# EAGLE design isl-test (EAGLE 6.1)
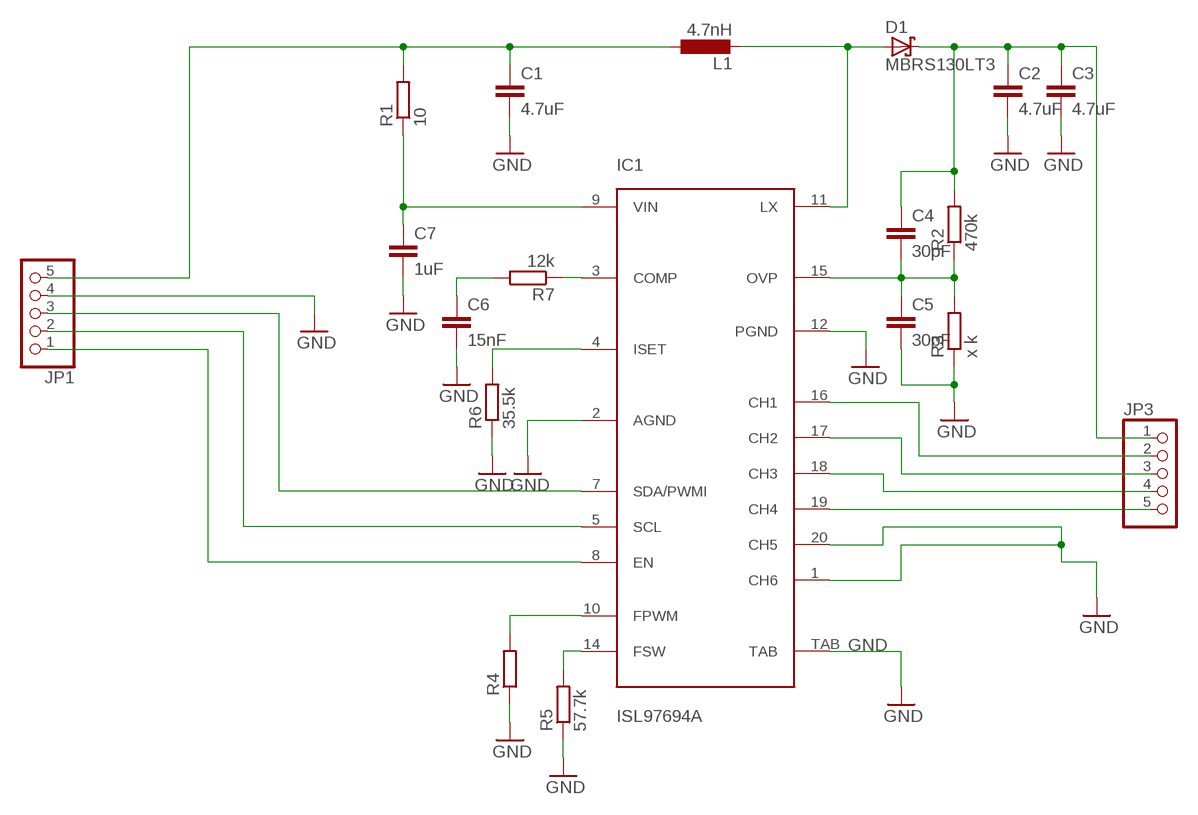
[diagram p0: schematic, sheet 1]

## Parts
C1  4.7uF  C-EUC0805  [C0805]
C2  4.7uF  C-EUC0805  [C0805]
C3  4.7uF  C-EUC0805  [C0805]
C4  30pF  C-EUC0603  [C0603]
C5  30pF  C-EUC0603  [C0603]
C6  15nF  C-EUC0603  [C0603]
C7  1uF  C-EUC0603  [C0603]
D1  MBRS130LT3  [SMB]
IC1  ISL97694A  [TQFN-20]
JP1  PINHD-1X5  [1X05]
JP3  PINHD-1X5  [1X05]
L1  4.7nH  L-EUL1812  [L1812]
R1  10  R-EU_R0603  [R0603]
R2  470k  R-EU_R0603  [R0603]
R3  x k  R-EU_R0603  [R0603]
R4  R-EU_R0603  [R0603]
R5  57.7k  R-EU_R0603  [R0603]
R6  35.5k  R-EU_R0603  [R0603]
R7  12k  R-EU_R0603  [R0603]

## Nets
GND: C1.2 C2.2 C3.2 C5.2 C6.2 C7.2 IC1.1(CH6) IC1.2(AGND) IC1.12(PGND) IC1.20(CH5) IC1.TAB JP1.4 R3.1 R4.1 R5.1 R6.1
N$2: C1.1 JP1.5 L1.1 R1.2
N$3: D1.A IC1.11(LX) L1.2
N$5: C4.2 C5.1 IC1.15(OVP) R2.1 R3.2
N$6: C2.1 C3.1 C4.1 D1.C JP3.1 R2.2
N$8: IC1.3(COMP) R7.1
N$9: C6.1 R7.2
N$11: IC1.4(ISET) R6.2
N$12: IC1.10(FPWM) R4.2
N$13: IC1.14(FSW) R5.2
N$14: IC1.8(EN) JP1.1
N$15: IC1.5(SCL) JP1.2
N$16: IC1.7(SDA/PWMI) JP1.3
N$21: IC1.16(CH1) JP3.2
N$22: IC1.17(CH2) JP3.3
N$23: IC1.18(CH3) JP3.4
N$24: IC1.19(CH4) JP3.5
VIN: C7.1 IC1.9(VIN) R1.1

## Library data of the parts
C1-C7 = rcl:C-EU: CAPACITOR, European symbol
D1 = diode:MBRS130LT3: Schottky Power Rectifier Source: http://www.onsemi.com/pub/Collateral/MBRS130LT3-D.PDF
IC1 = xtort:ISL97694A
JP1 JP3 = pinhead:PINHD-1X5: PIN HEADER
L1 = rcl:L-EU: INDUCTOR, European symbol
R1-R7 = rcl:R-EU_: RESISTOR, European symbol

## Board
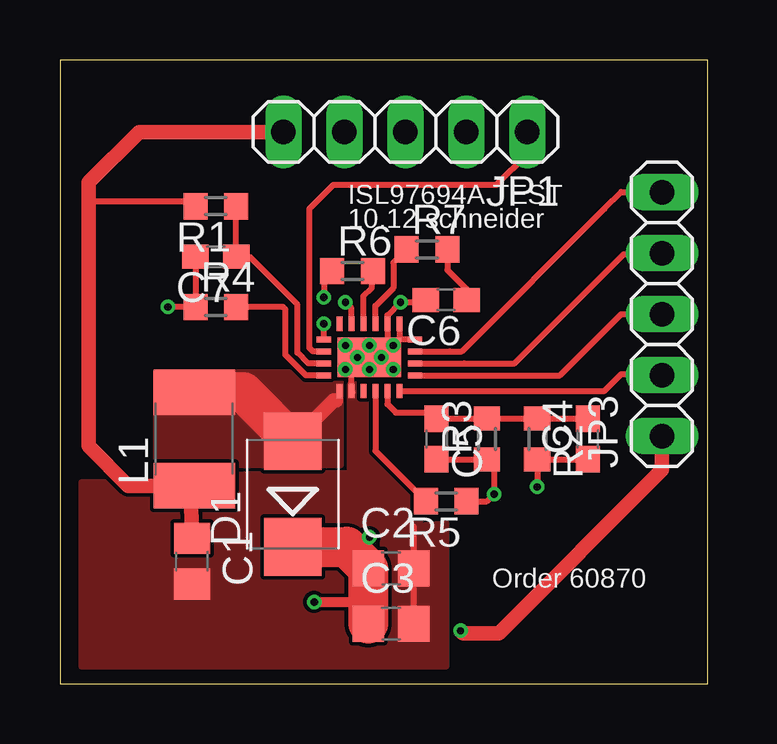
[diagram p1: board, top side]
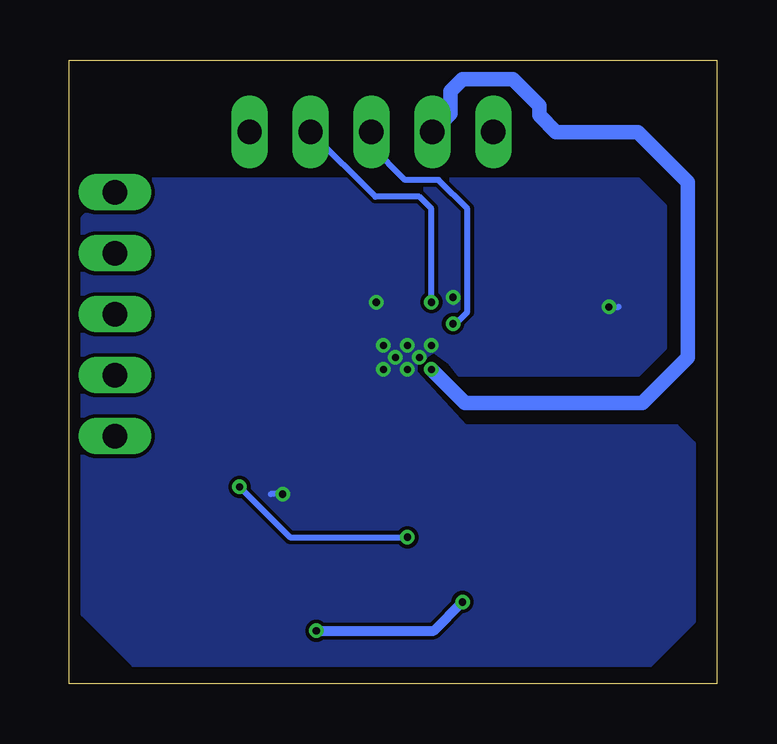
[diagram p2: board, bottom side, seen from below]

Size 27 x 26 mm. Coordinates in mm from the lower left corner, seen from the top.
Outline: 0,26 0,0 27,0 27,26 0,26
Copper layers (1*16): Top 0.035mm / dielectric 1.5mm / Bottom 0.035mm
Design rules: minimum track width 6mil, minimum drill 0.3mm, track to track 6mil, track to pad 6mil, pad to pad 6mil, via to via 6mil, smd to smd 0mil, copper to edge 10mil, drill to drill 10mil, minimum pad ring 10mil, minimum via ring 6mil, stop-mask expansion 2mil, vias tented up to drill 100mil, thermal gap 10mil

### Footprints (pad centres in the part's own frame; a part is rotated, then mirrored left to right if it is on the bottom)
C0805 = smd 1.3 x 1.5: 1 -0.95,0; 2 0.95,0
C0603 = smd 1.1 x 1: 1 -0.85,0; 2 0.85,0
SMB = smd 2.4 x 2.4: A 2.2,0; C -2.2,0
TQFN-20 = smd 0.6 x 0.25: 1 -1.4,1.25; 2 -1.4,0.75; 3 -1.4,0.25; 4 -1.4,-0.25; 5 -1.4,-0.75; 6 -1.4,-1.25; 11 1.4,-1.25; 12 1.4,-0.75; 13 1.4,-0.25; 14 1.4,0.25; 15 1.4,0.75; 16 1.4,1.25 | smd 0.25 x 0.6: 7 -0.75,-1.9; 8 -0.25,-1.9; 9 0.25,-1.9; 10 0.75,-1.9; 17 0.75,1.9; 18 0.25,1.9; 19 -0.25,1.9; 20 -0.75,1.9 | smd 1.65 x 2.65: TAB 0,0
1X05 = drill 1.016 long: 1 -5.08,0; 2 -2.54,0; 3 0,0; 4 2.54,0; 5 5.08,0
L1812 = smd 1.9 x 3.4: 1 -1.95,0; 2 1.95,0
R0603 = smd 1 x 1.1: 1 -0.85,0; 2 0.85,0

### Placement (x,y rotation side)
C1  5.5,5.1 270 top
C2  13.8,4.8 0 top
C3  13.8,2.5 0 top
C4  22,10.2 90 top
C5  15.7,10.2 270 top
C6  16.1,16 180 top
C7  6.5,17.8 180 top
D1  9.7,7.9 90 top
IC1  12.9,13.6 270 top
JP1  14.4,23 180 top
JP3  25.1,15.4 90 top
L1  5.6,10.2 90 top
R1  6.5,19.9 180 top
R2  19.9,10.2 270 top
R3  17.8,10.2 90 top
R4  6.5,15.7 0 top
R5  16.1,7.6 180 top
R6  12.2,17.2 0 top
R7  15.3,18.1 0 top

### Tracks (layer width: path | path; a pad name or v marks a point on that pad's centre or on a via)
GND  (via drill 0.3, 0.3 pad 0.5)
  Top 0.25: R6.1 11,16.85 v11,16.1 | C6.2 15.15,15.9 v14.2,15.9 13.65,15.35 IC1.2 13.65,14.35 v13.9,14.1 14.15,14.35 | C7.2 R4.1 v4.5,15.7 | C5.2 R3.1 18.1,9.05 v18.1,7.9 17.8,7.6 R5.1 | 12.2,12.15 IC1.12 12.15,12.85 v11.9,13.1 v12.4,13.6 IC1.TAB | C3.2 C2.2 14.75,6.55 | IC1.1 14.15,14.35 | IC1.20 14.15,14.35
  Bottom 0.25: v11,16.1 11,15.9 | v4.5,15.7 4.1,15.7 | v18.1,7.9 18.6,7.9
  Bottom 0.61: JP1.4 11.1,23.76 11.1,24.7 10.6,25.2 8.5,25.2 7.4,24.1 7.4,23.7 6.7,23 3.3,23 1.2,20.9 1.2,13.6 3.1,11.7 10.5,11.7 v11.9,13.1
  other vias: 12.9,14.1 11.9,14.1 13.4,13.6 13.9,13.1 12.9,13.1
  pour Top (no thermals): 0.9,8.4 4.7,8.4 4.7,8.7 12.1,8.8 12.1,12.5 13.3,12.5 13.4,9.1 15,7.5 15,6.6 16.1,6.7 16.1,0.7 0.9,0.7
  pour Bottom (no thermals): 24.8,21 3.3,21 2.2,19.9 2.2,14 3.3,12.9 10.7,12.9 11.1,13.4 11.8,13.9 12.4,13.5 12.6,13.4 12.6,13 10.5,10.7 1.7,10.7 1,10 1,2.6 2.8,0.8 24.3,0.8 26.4,2.9 26.4,19.4
N$2
  Top 0.25: R1.2 5.45,20.1 1.2,20.1
  Top 0.61: C1.1 5.45,8.1 L1.1 2.85,8.25 1.2,9.9 1.2,20.1 1.2,20.9 3.3,23 JP1.5
N$3
  Top 0.25: IC1.11 11.65,11.95 11.5,11.8
  Top 0.61: 11.5,11.8 11.4,11.8 D1.A
  Top 1.676: L1.2 7.65,12.15 D1.A
  pour Top (no thermals): 4,13 11.7,13 11.7,9.1 4,9.1
N$5
  Top 0.25: IC1.15 13.65,11.65 14,11.3 15.45,11.3 C5.1 R3.2 R2.1 C4.2
N$6  (via drill 0.3)
  Top 0.25: C4.1 R2.2 v19.9,8.2 | v12.9,6.1 12.22,5.42
  Top 0.406: v10.6,3.4 12.8,3.4 12.8,2.55 C3.1
  Top 0.61: JP3.1 25.1,8.9 18.3,2.1 16.8,2.1 v16.7,2.2
  Top 1.676: D1.C 11.95,5.7 12.22,5.42 C2.1 C3.1
  Bottom 0.25: v19.9,8.2 17.8,6.1 v12.9,6.1
  Bottom 0.406: v16.7,2.2 11.8,2.2 v10.6,3.4
N$8
  Top 0.25: IC1.3 13.15,15.75 13.9,16.5 13.9,17.55 R7.1
N$9
  Top 0.25: R7.2 16.15,17.25 16.95,16.45 C6.1
N$11
  Top 0.25: IC1.4 12.65,16.15 13,16.5 13,17.15 R6.2
N$12
  Top 0.25: IC1.10 10.25,12.85 9.4,13.7 9.4,15.6 9.3,15.7 R4.2
N$13
  Top 0.25: IC1.14 13.15,9.7 R5.2
N$14
  Top 0.25: IC1.8 10.55,13.85 10.4,14 10.4,19.8 11.4,20.8 18.2,20.8 19.48,22.08 JP1.1
N$15  (via drill 0.3)
  Top 0.25: IC1.5 12.15,15.65 v11.9,15.9
  Bottom 0.25: v11.9,15.9 11.9,19.8 12.4,20.3 14.24,20.3 JP1.2
N$16  (via drill 0.3)
  Top 0.25: IC1.7 v11,15
  Bottom 0.25: v11,15 10.9,15 10.4,15.5 10.4,19.8 11.6,21 13,21 14.4,22.4 JP1.3
N$21
  Top 0.25: IC1.16 22.7,12.2 23.4,12.9 25.06,12.9 JP3.2
N$22
  Top 0.25: IC1.17 20.85,12.85 23.4,15.4 JP3.3
N$23
  Top 0.25: IC1.18 16.85,13.35 | 23.2,17.6 23.5,17.9 25.06,17.9 JP3.4
  Top 0.254: 16.85,13.35 18.95,13.35 23.2,17.6
N$24
  Top 0.25: IC1.19 16.25,13.85 | 22.7,19.8 23.4,20.5 25.08,20.5 JP3.5
  Top 0.254: 16.25,13.85 16.75,13.85 22.7,19.8
VIN
  Top 0.25: IC1.9 10.35,13.35 9.9,13.8 9.9,15.8 7.9,17.8 C7.1 R1.1

### Text on the board
tPlace: ISL97694A TEST | 10.12 schneider | Order 60870